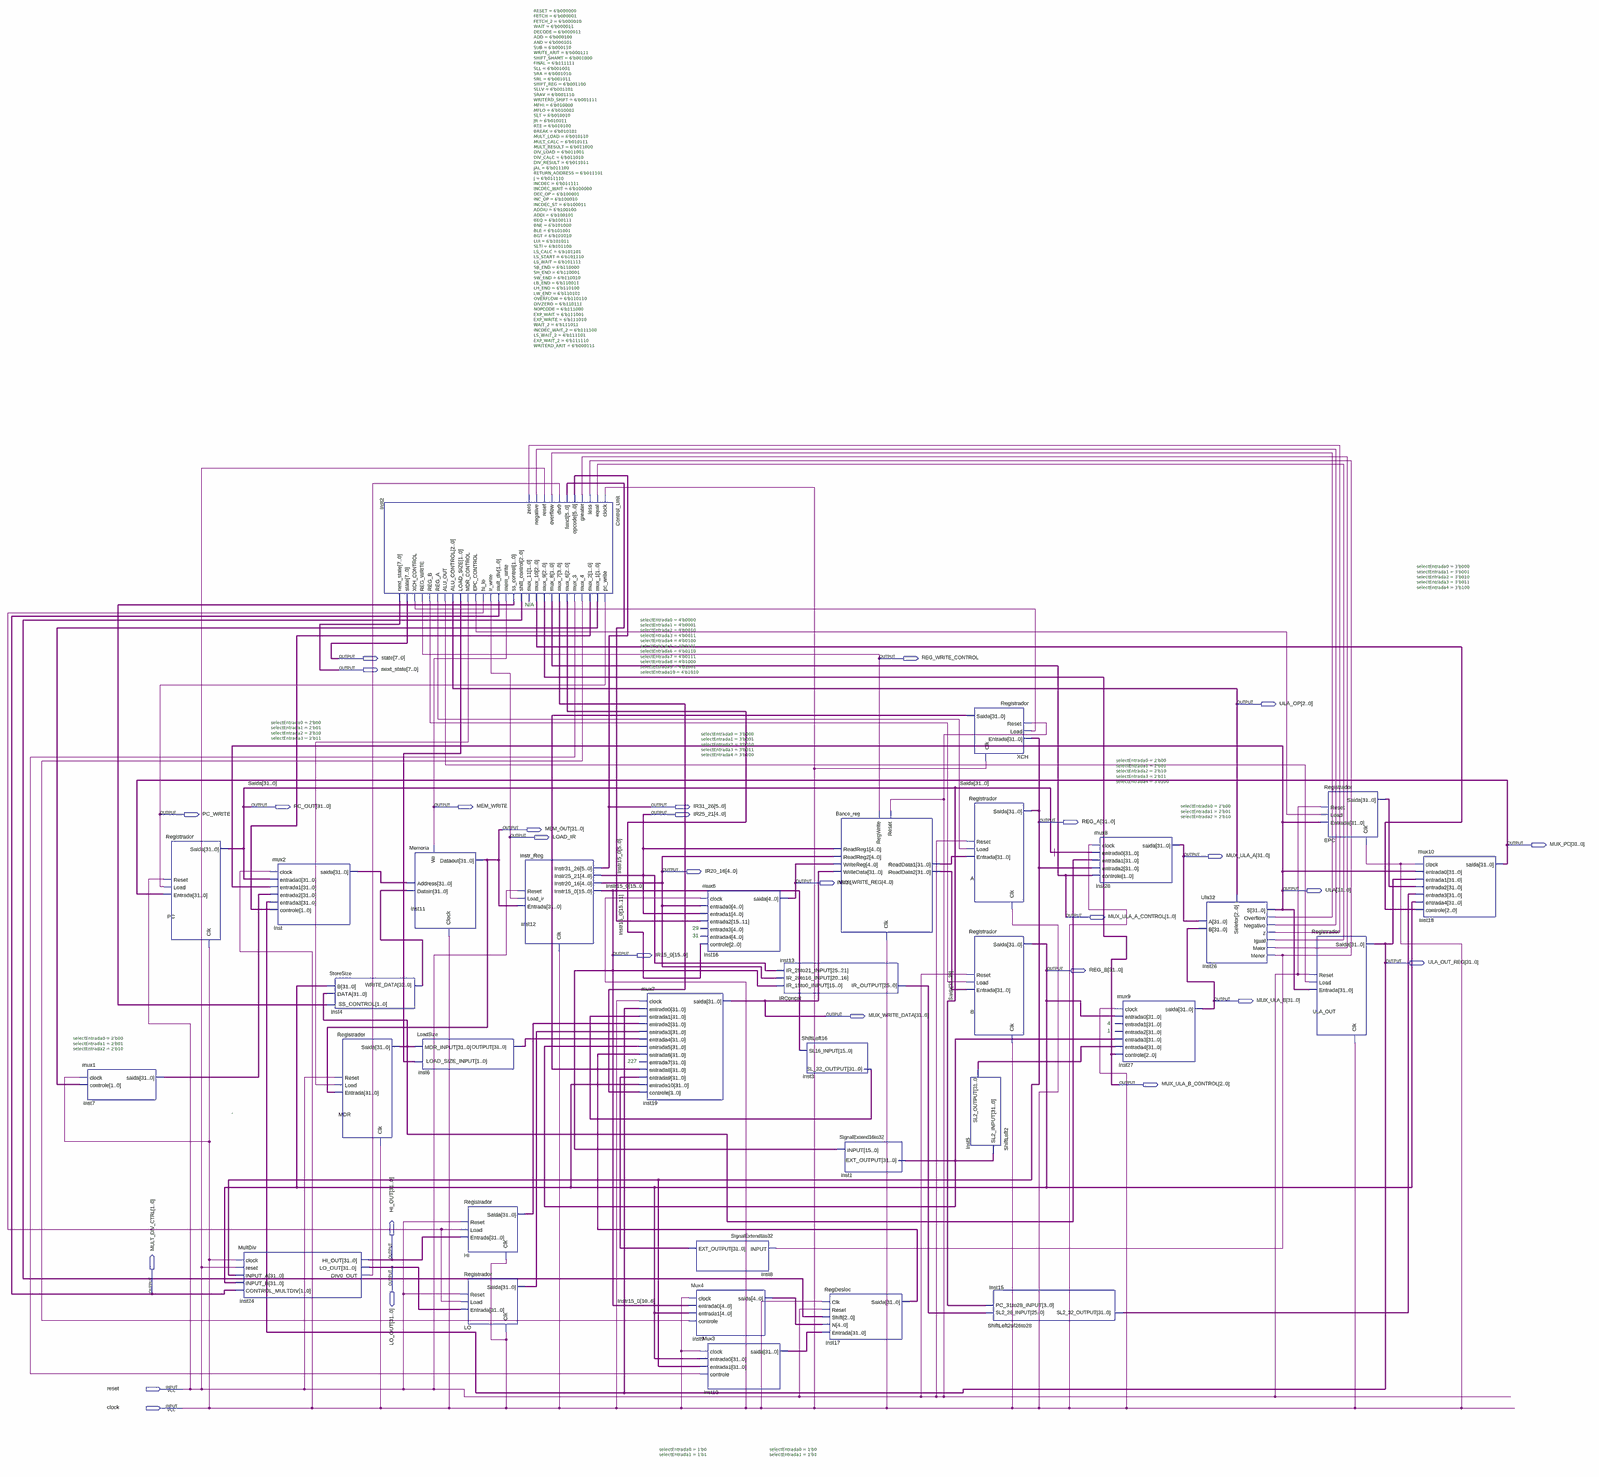
[diagram p0: schematic sheet, whole]
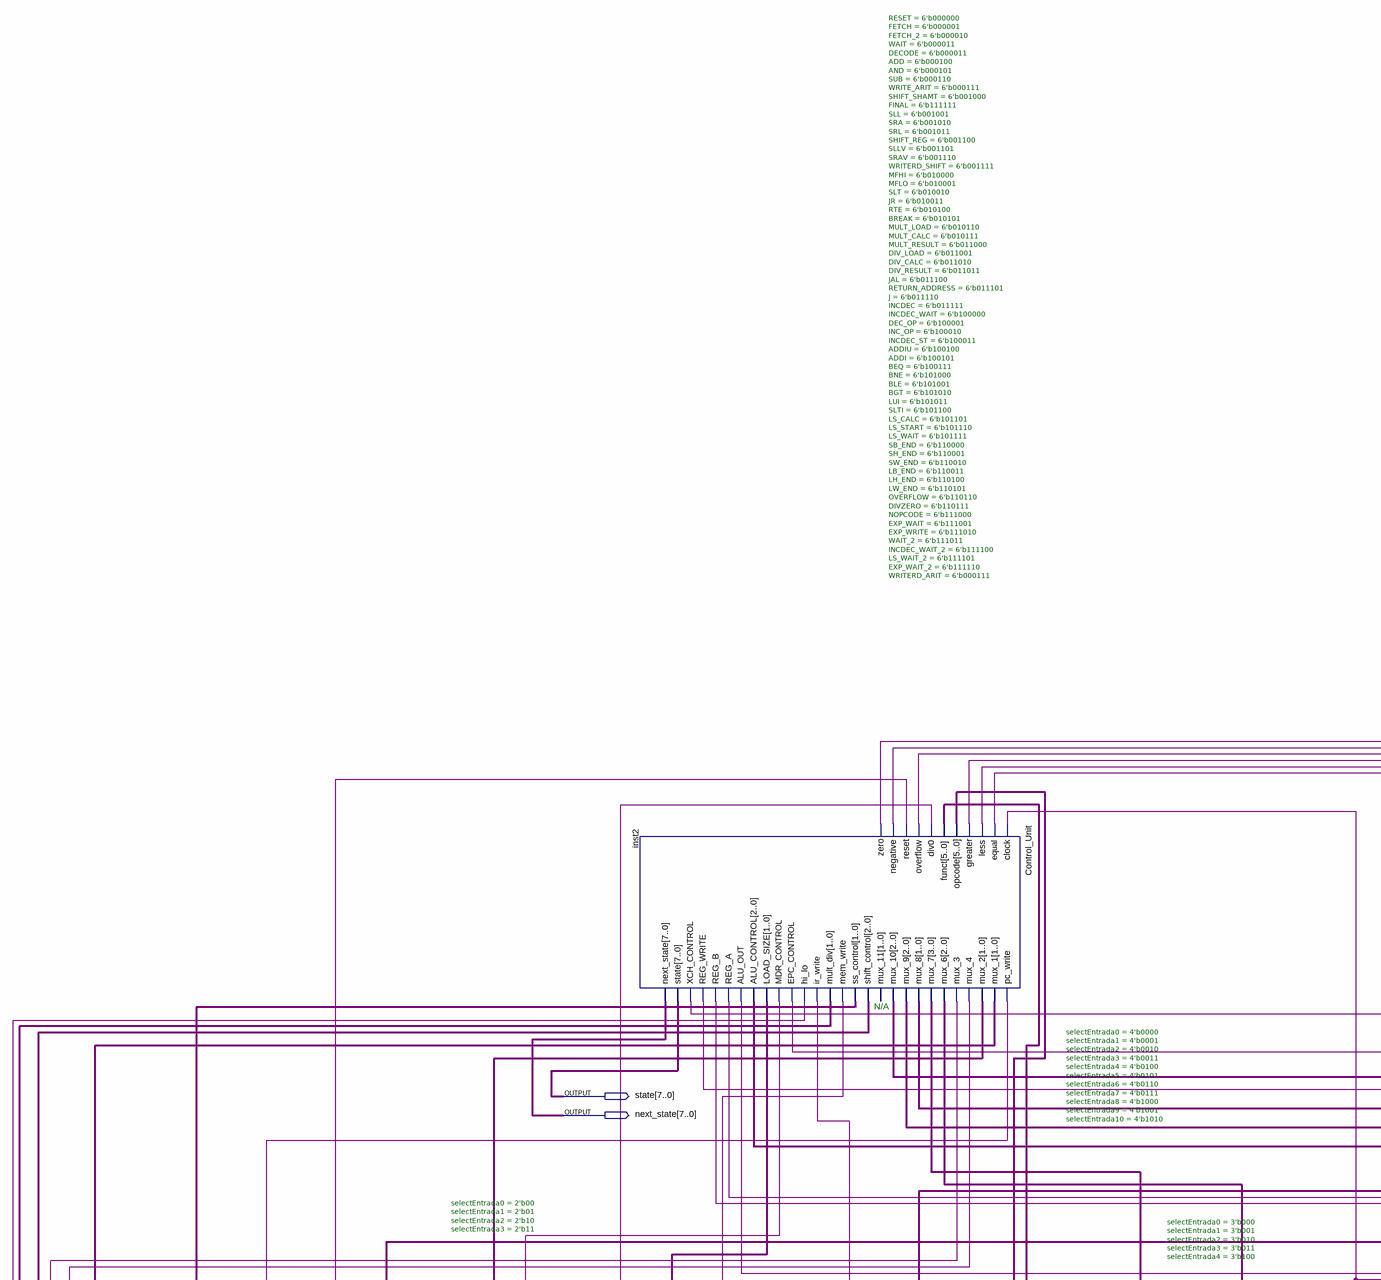
[diagram p1: schematic sheet, upper left part]
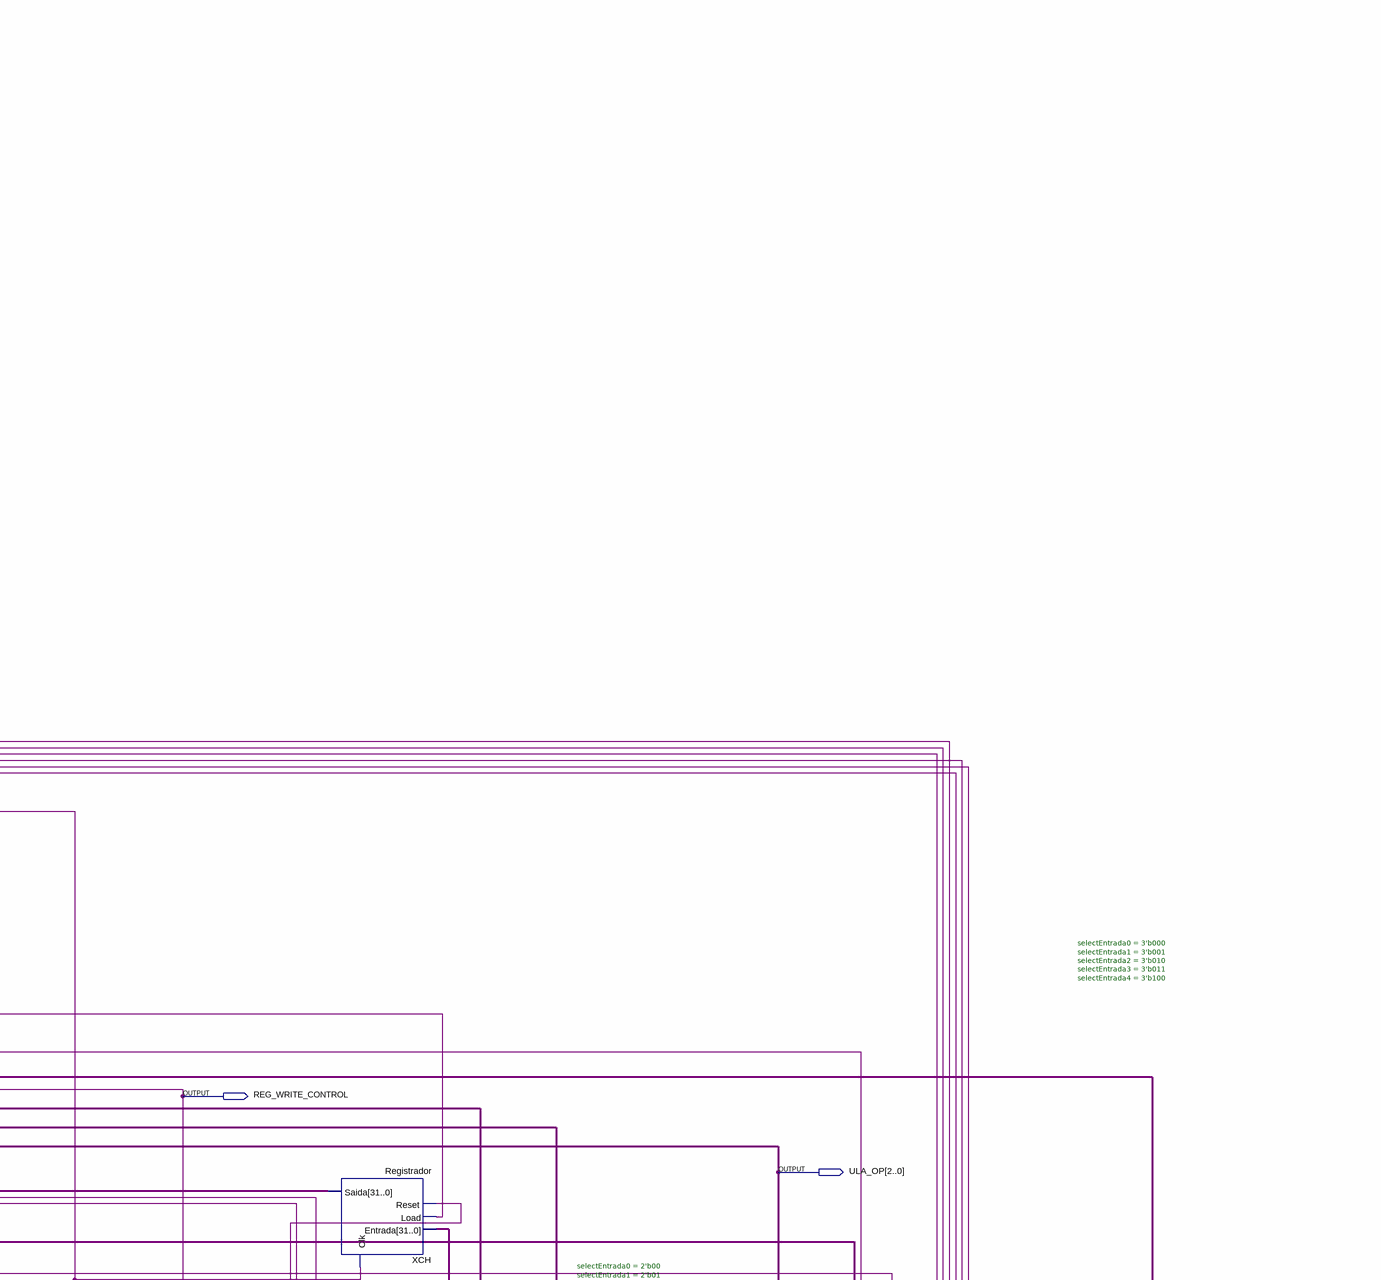
[diagram p2: schematic sheet, upper right part]
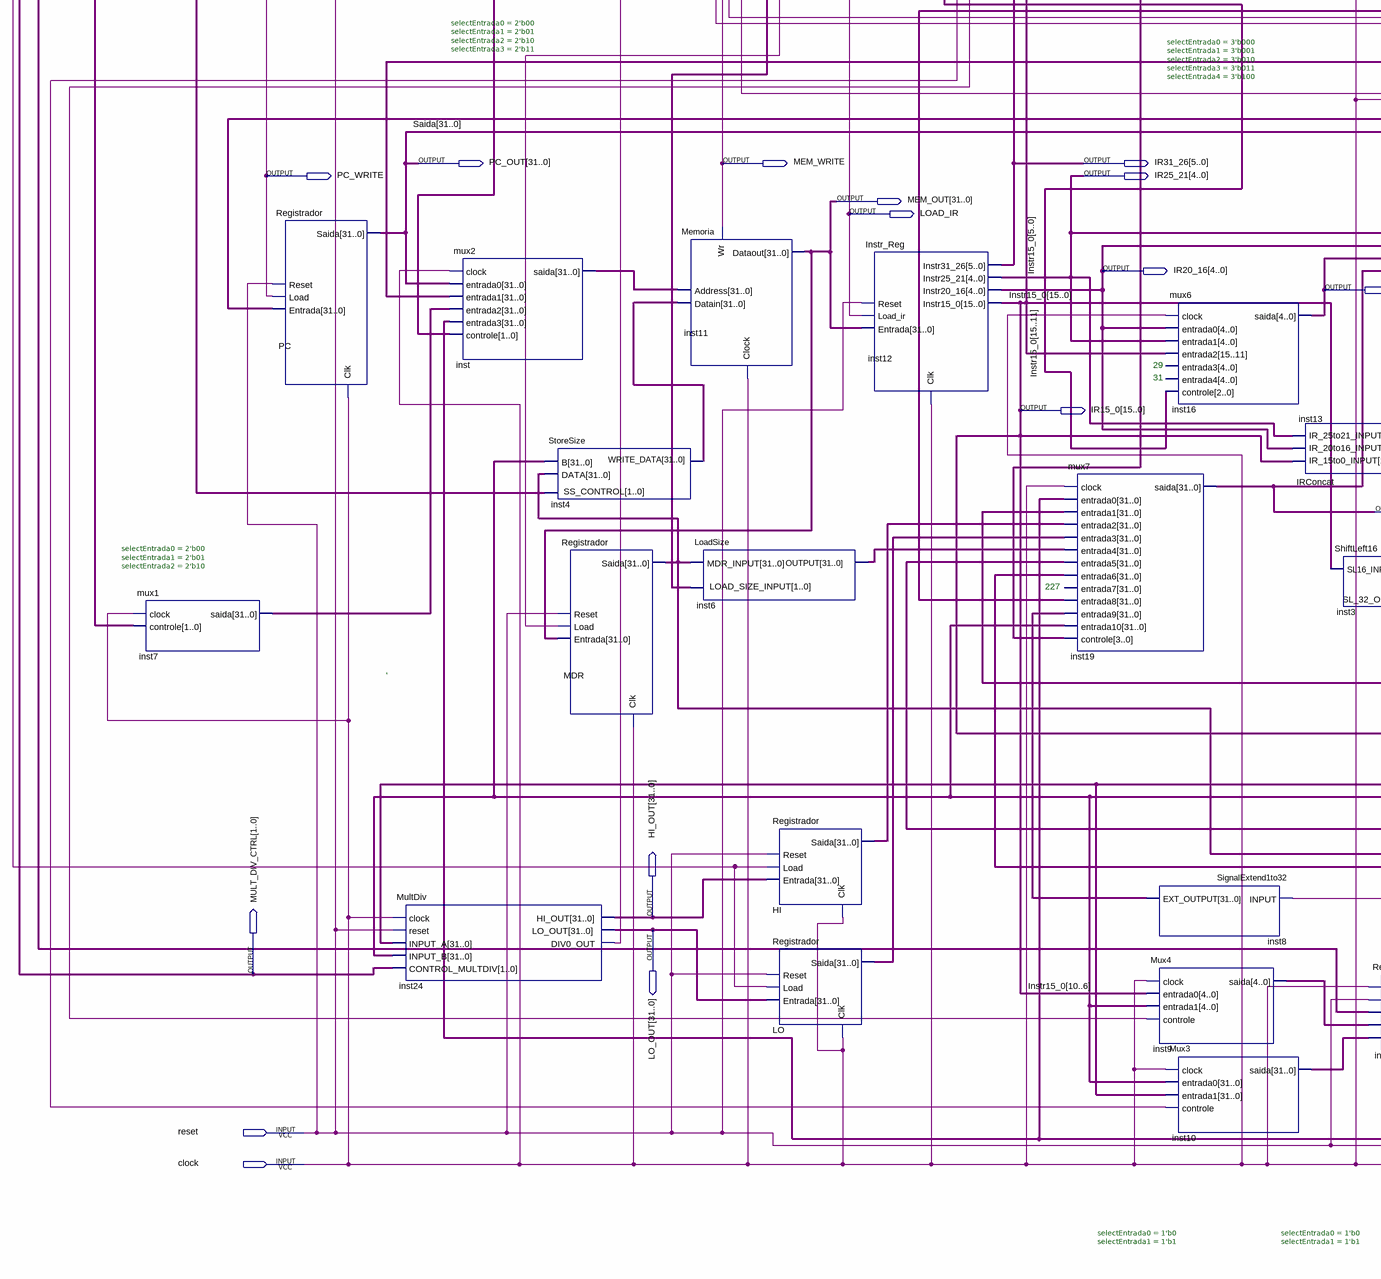
[diagram p3: schematic sheet, lower left part]
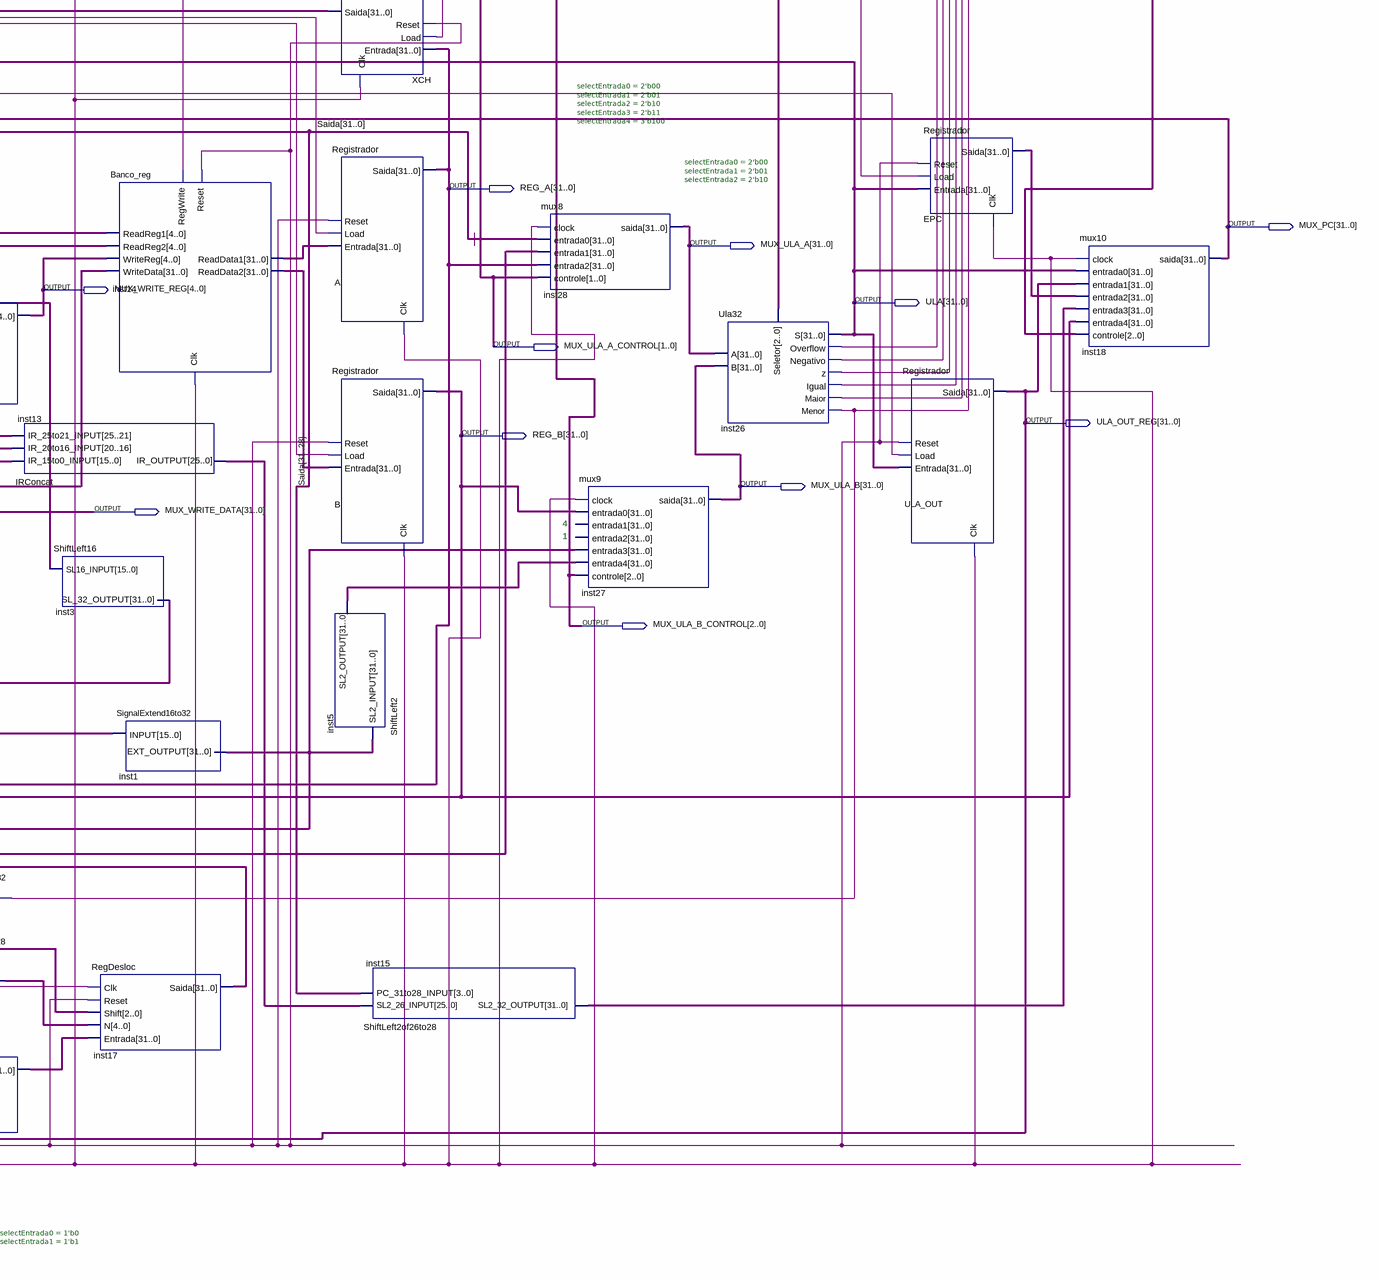
[diagram p4: schematic sheet, lower right part]
// Quartus schematic Processador.bdf as structural Verilog: 33 symbols, 29 pins
module Processador (
  input  reset,
  input  clock,
  output [7:0] state,
  output REG_WRITE_CONTROL,
  output [7:0] next_state,
  output [2:0] ULA_OP,
  output [31:0] PC_OUT,
  output MEM_WRITE,
  output [5:0] IR31_26,
  output PC_WRITE,
  output [4:0] IR25_21,
  output [31:0] REG_A,
  output [31:0] MEM_OUT,
  output LOAD_IR,
  output [31:0] MUX_PC,
  output [31:0] MUX_ULA_A,
  output [4:0] IR20_16,
  output [4:0] MUX_WRITE_REG,
  output [31:0] ULA,
  output [1:0] MUX_ULA_A_CONTROL,
  output [15:0] IR15_0,
  output [31:0] ULA_OUT_REG,
  output [31:0] REG_B,
  output [31:0] MUX_ULA_B,
  output [31:0] MUX_WRITE_DATA,
  output [2:0] MUX_ULA_B_CONTROL,
  output [31:0] HI_OUT,
  output [31:0] LO_OUT,
  output [1:0] MULT_DIV_CTRL
);

  wire inst2_alu_out, inst2_epc_control, inst2_hi_lo, inst2_mdr_control, inst2_mux_3, inst2_mux_4,
       inst2_reg_a, inst2_reg_b, inst2_xch_control, inst24_div0_out, inst26_igual, inst26_maior,
       inst26_menor, inst26_negativo, inst26_overflow, inst26_z;
  wire [1:0] inst2_load_size, inst2_mux_1, inst2_mux_2, inst2_ss_control;
  wire [2:0] inst2_mux_6, inst2_mux_10, inst2_shift_control;
  wire [3:0] inst2_mux_7;
  wire [4:0] inst9_saida;
  wire [25:0] inst13_ir_output;
  wire [31:0] EPC_saida, HI_saida, inst1_ext_output, inst3_sl_32_output, inst4_write_data, inst5_sl2_output,
       inst6_output, inst7_saida, inst8_ext_output, inst10_saida, inst14_readdata1, inst14_readdata2,
       inst15_sl2_32_output, inst17_saida, inst_saida, LO_saida, MDR_saida, XCH_saida;

  mux1 #(.selectEntrada0(2'b00), .selectEntrada1(2'b01), .selectEntrada2(2'b10)) inst7 (
    .clock(clock), .controle(inst2_mux_1), .saida(inst7_saida));
  Registrador PC (.Clk(clock), .Reset(reset), .Load(PC_WRITE), .Entrada(MUX_PC), .Saida(PC_OUT));
  MultDiv inst24 (
    .clock(clock), .reset(reset), .INPUT_A(REG_A), .INPUT_B(REG_B), .CONTROL_MULTDIV(MULT_DIV_CTRL),
    .HI_OUT(HI_OUT), .LO_OUT(LO_OUT), .DIV0_OUT(inst24_div0_out));
  mux2 #(.selectEntrada0(2'b00), .selectEntrada1(2'b01), .selectEntrada2(2'b10), .selectEntrada3(2'b11)) inst (
    .clock(clock), .entrada0(PC_OUT), .entrada1(ULA), .entrada2(inst7_saida), .entrada3(ULA_OUT_REG),
    .controle(inst2_mux_2), .saida(inst_saida));
  StoreSize inst4 (.B(REG_B), .DATA(MDR_saida), .SS_CONTROL(inst2_ss_control), .WRITE_DATA(inst4_write_data));
  Registrador MDR (.Clk(clock), .Reset(reset), .Load(inst2_mdr_control), .Entrada(MEM_OUT), .Saida(MDR_saida));
  Control_Unit #(.RESET(6'b000000), .FETCH(6'b000001), .FETCH_2(6'b000010), .WAIT(6'b000011), .DECODE(6'b000011), .ADD(6'b000100), .AND(6'b000101), .SUB(6'b000110), .WRITE_ARIT(6'b000111), .SHIFT_SHAMT(6'b001000), .FINAL(6'b111111), .SLL(6'b001001), .SRA(6'b001010), .SRL(6'b001011), .SHIFT_REG(6'b001100), .SLLV(6'b001101), .SRAV(6'b001110), .WRITERD_SHIFT(6'b001111), .MFHI(6'b010000), .MFLO(6'b010001), .SLT(6'b010010), .JR(6'b010011), .RTE(6'b010100), .BREAK(6'b010101), .MULT_LOAD(6'b010110), .MULT_CALC(6'b010111), .MULT_RESULT(6'b011000), .DIV_LOAD(6'b011001), .DIV_CALC(6'b011010), .DIV_RESULT(6'b011011), .JAL(6'b011100), .RETURN_ADDRESS(6'b011101), .J(6'b011110), .INCDEC(6'b011111), .INCDEC_WAIT(6'b100000), .DEC_OP(6'b100001), .INC_OP(6'b100010), .INCDEC_ST(6'b100011), .ADDIU(6'b100100), .ADDI(6'b100101), .BEQ(6'b100111), .BNE(6'b101000), .BLE(6'b101001), .BGT(6'b101010), .LUI(6'b101011), .SLTI(6'b101100), .LS_CALC(6'b101101), .LS_START(6'b101110), .LS_WAIT(6'b101111), .SB_END(6'b110000), .SH_END(6'b110001), .SW_END(6'b110010), .LB_END(6'b110011), .LH_END(6'b110100), .LW_END(6'b110101), .OVERFLOW(6'b110110), .DIVZERO(6'b110111), .NOPCODE(6'b111000), .EXP_WAIT(6'b111001), .EXP_WRITE(6'b111010), .WAIT_2(6'b111011), .INCDEC_WAIT_2(6'b111100), .LS_WAIT_2(6'b111101), .EXP_WAIT_2(6'b111110), .WRITERD_ARIT(6'b000111)) inst2 (
    .clock(clock), .equal(inst26_igual), .less(inst26_menor), .greater(inst26_maior), .opcode(IR31_26),
    .funct(IR15_0[5:0]), .div0(inst24_div0_out), .overflow(inst26_overflow), .reset(reset),
    .negative(inst26_negativo), .zero(inst26_z), .pc_write(PC_WRITE), .mux_1(inst2_mux_1),
    .mux_2(inst2_mux_2), .mux_4(inst2_mux_4), .mux_3(inst2_mux_3), .mux_6(inst2_mux_6), .mux_7(inst2_mux_7),
    .mux_8(MUX_ULA_A_CONTROL), .mux_9(MUX_ULA_B_CONTROL), .mux_10(inst2_mux_10),
    .shift_control(inst2_shift_control), .ss_control(inst2_ss_control), .mem_write(MEM_WRITE),
    .mult_div(MULT_DIV_CTRL), .ir_write(LOAD_IR), .hi_lo(inst2_hi_lo), .EPC_CONTROL(inst2_epc_control),
    .MDR_CONTROL(inst2_mdr_control), .LOAD_SIZE(inst2_load_size), .ALU_CONTROL(ULA_OP),
    .ALU_OUT(inst2_alu_out), .REG_A(inst2_reg_a), .REG_B(inst2_reg_b), .REG_WRITE(REG_WRITE_CONTROL),
    .XCH_CONTROL(inst2_xch_control), .state(state), .next_state(next_state));  // open: mux_11
  Memoria inst11 (.Address(inst_saida), .Clock(clock), .Wr(MEM_WRITE), .Datain(inst4_write_data), .Dataout(MEM_OUT));
  LoadSize inst6 (.MDR_INPUT(MDR_saida), .LOAD_SIZE_INPUT(inst2_load_size), .OUTPUT(inst6_output));
  Registrador HI (.Clk(clock), .Reset(reset), .Load(inst2_hi_lo), .Entrada(HI_OUT), .Saida(HI_saida));
  Registrador LO (.Clk(clock), .Reset(reset), .Load(inst2_hi_lo), .Entrada(LO_OUT), .Saida(LO_saida));
  Instr_Reg inst12 (
    .Clk(clock), .Reset(reset), .Load_ir(LOAD_IR), .Entrada(MEM_OUT), .Instr31_26(IR31_26),
    .Instr25_21(IR25_21), .Instr20_16(IR20_16), .Instr15_0(IR15_0));
  mux7 #(.selectEntrada0(4'b0000), .selectEntrada1(4'b0001), .selectEntrada2(4'b0010), .selectEntrada3(4'b0011), .selectEntrada4(4'b0100), .selectEntrada5(4'b0101), .selectEntrada6(4'b0110), .selectEntrada7(4'b0111), .selectEntrada8(4'b1000), .selectEntrada9(4'b1001), .selectEntrada10(4'b1010)) inst19 (
    .clock(clock), .entrada0(ULA_OUT_REG), .entrada1(inst3_sl_32_output), .entrada2(HI_saida),
    .entrada3(LO_saida), .entrada4(inst6_output), .entrada5(inst1_ext_output), .entrada6(inst17_saida),
    .entrada8(XCH_saida), .entrada9(inst8_ext_output), .entrada10(REG_B), .controle(inst2_mux_7),
    .saida(MUX_WRITE_DATA));  // open: entrada7
  mux6 #(.selectEntrada0(3'b000), .selectEntrada1(3'b001), .selectEntrada2(3'b010), .selectEntrada3(3'b011), .selectEntrada4(3'b100)) inst16 (
    .clock(clock), .entrada0(IR20_16), .entrada1(IR25_21), .entrada2(IR15_0[15:11]), .controle(inst2_mux_6),
    .saida(MUX_WRITE_REG));  // open: entrada3, entrada4
  SignalExtend1to32 inst8 (.INPUT(inst26_menor), .EXT_OUTPUT(inst8_ext_output));
  Mux4 #(.selectEntrada0(1'b0), .selectEntrada1(1'b1)) inst9 (
    .clock(clock), .entrada0(IR15_0[10:6]), .entrada1(REG_B[4:0]), .controle(inst2_mux_4), .saida(inst9_saida));
  Mux3 #(.selectEntrada0(1'b0), .selectEntrada1(1'b1)) inst10 (
    .clock(clock), .entrada0(REG_B), .entrada1(REG_A), .controle(inst2_mux_3), .saida(inst10_saida));
  IRConcat inst13 (
    .IR_15to0_INPUT(IR15_0), .IR_20to16_INPUT(IR20_16), .IR_25to21_INPUT(IR25_21),
    .IR_OUTPUT(inst13_ir_output));
  ShiftLeft16 inst3 (.SL16_INPUT(IR15_0), .SL_32_OUTPUT(inst3_sl_32_output));
  Banco_reg inst14 (
    .Clk(clock), .Reset(reset), .RegWrite(REG_WRITE_CONTROL), .ReadReg1(IR25_21), .ReadReg2(IR20_16),
    .WriteReg(MUX_WRITE_REG), .WriteData(MUX_WRITE_DATA), .ReadData1(inst14_readdata1),
    .ReadData2(inst14_readdata2));
  RegDesloc inst17 (
    .Clk(clock), .Reset(reset), .Shift(inst2_shift_control), .N(inst9_saida), .Entrada(inst10_saida),
    .Saida(inst17_saida));
  SignalExtend16to32 inst1 (.INPUT(IR15_0), .EXT_OUTPUT(inst1_ext_output));
  Registrador XCH (.Clk(clock), .Reset(reset), .Load(inst2_xch_control), .Entrada(REG_A), .Saida(XCH_saida));
  Registrador A (.Clk(clock), .Reset(reset), .Load(inst2_reg_a), .Entrada(inst14_readdata1), .Saida(REG_A));
  Registrador B (.Clk(clock), .Reset(reset), .Load(inst2_reg_b), .Entrada(inst14_readdata2), .Saida(REG_B));
  ShiftLeft2 inst5 (.SL2_INPUT(inst1_ext_output), .SL2_OUTPUT(inst5_sl2_output));
  ShiftLeft2of26to28 inst15 (
    .SL2_26_INPUT(inst13_ir_output), .PC_31to28_INPUT(PC_OUT[31:28]), .SL2_32_OUTPUT(inst15_sl2_32_output));
  mux8 #(.selectEntrada0(2'b00), .selectEntrada1(2'b01), .selectEntrada2(2'b10)) inst28 (
    .clock(clock), .entrada0(PC_OUT), .entrada1(MDR_saida), .entrada2(REG_A), .controle(MUX_ULA_A_CONTROL),
    .saida(MUX_ULA_A));
  mux9 #(.selectEntrada0(2'b00), .selectEntrada1(2'b01), .selectEntrada2(2'b10), .selectEntrada3(2'b11), .selectEntrada4(3'b100)) inst27 (
    .clock(clock), .entrada0(REG_B), .entrada3(inst1_ext_output), .entrada4(inst5_sl2_output),
    .controle(MUX_ULA_B_CONTROL), .saida(MUX_ULA_B));  // open: entrada1, entrada2
  Ula32 inst26 (
    .A(MUX_ULA_A), .B(MUX_ULA_B), .Seletor(ULA_OP), .S(ULA), .Overflow(inst26_overflow),
    .Negativo(inst26_negativo), .z(inst26_z), .Igual(inst26_igual), .Maior(inst26_maior), .Menor(inst26_menor));
  Registrador EPC (.Clk(clock), .Reset(reset), .Load(inst2_epc_control), .Entrada(ULA), .Saida(EPC_saida));
  Registrador ULA_OUT (.Clk(clock), .Reset(reset), .Load(inst2_alu_out), .Entrada(ULA), .Saida(ULA_OUT_REG));
  mux10 #(.selectEntrada0(3'b000), .selectEntrada1(3'b001), .selectEntrada2(3'b010), .selectEntrada3(3'b011), .selectEntrada4(3'b100)) inst18 (
    .clock(clock), .entrada0(ULA), .entrada1(ULA_OUT_REG), .entrada2(EPC_saida),
    .entrada3(inst15_sl2_32_output), .entrada4(REG_B), .controle(inst2_mux_10), .saida(MUX_PC));

  // Other names for the same wires on the sheet: Instr15_0[15:0] = IR15_0; Saida[31:0] = PC_OUT; B_OUT[31:0] = REG_B

  // Notes on the sheet:
  //   N/A
  //   29
  //   31
  //   4
  //   1
  //   227
  //   '
endmodule
